# Altium schematic sheet alu_schem_2.SchDoc
size A; SheetNumber: 2; SheetTotal: 3
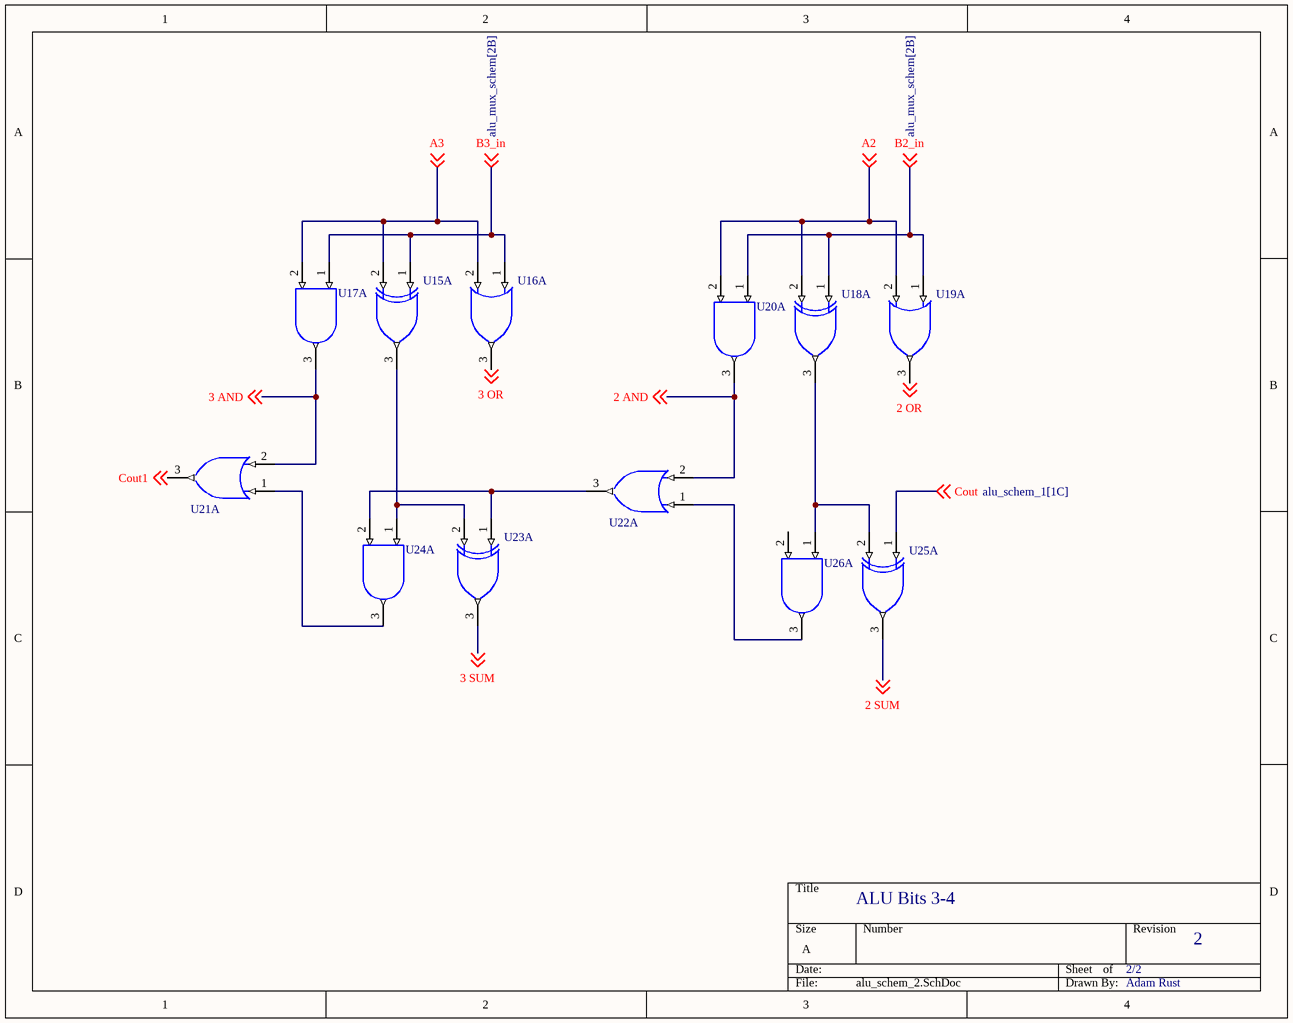
[diagram p0: alu_schem_2.SchDoc]

## Parts
U15  SN74LVC86ARGYR  [RGY0014A_V]  (value not drawn)  (part A of 5)
U16  SN74LVC32APWRG4  [PW0014A_N]  (value not drawn)  (part A of 5)
U17  SN74LVC08ADR  [D0014A_N]  (value not drawn)  (part A of 5)
U18  SN74LVC86ARGYR  [RGY0014A_V]  (value not drawn)  (part A of 5)
U19  SN74LVC32APWRG4  [PW0014A_N]  (value not drawn)  (part A of 5)
U20  SN74LVC08ADR  [D0014A_N]  (value not drawn)  (part A of 5)
U21  SN74LVC32APWRG4  [PW0014A_N]  (value not drawn)  (part A of 5)
U22  SN74LVC32APWRG4  [PW0014A_N]  (value not drawn)  (part A of 5)
U23  SN74LVC86ARGYR  [RGY0014A_V]  (value not drawn)  (part A of 5)
U24  SN74LVC08ADR  [D0014A_N]  (value not drawn)  (part A of 5)
U25  SN74LVC86ARGYR  [RGY0014A_V]  (value not drawn)  (part A of 5)
U26  SN74LVC08ADR  [D0014A_N]  (value not drawn)  (part A of 5)

## Nets
2 AND: U20.3(1Y) U22.2(1B) ; off-sheet 2 AND
2 OR: U19.3(1Y) ; off-sheet 2 OR
2 SUM: U25.3(1Y) ; off-sheet 2 SUM
3 AND: U17.3(1Y) U21.2(1B) ; off-sheet 3 AND
3 OR: U16.3(1Y) ; off-sheet 3 OR
3 SUM: U23.3(1Y) ; off-sheet 3 SUM
A2: U18.2(1B) U19.2(1B) U20.2(1B) ; off-sheet A2
A3: U15.2(1B) U16.2(1B) U17.2(1B) ; off-sheet A3
B2_in: U18.1(1A) U19.1(1A) U20.1(1A) ; off-sheet B2_in
B3_in: U15.1(1A) U16.1(1A) U17.1(1A) ; off-sheet B3_in
Cout: U25.1(1A) ; off-sheet Cout
Cout1: U21.3(1Y) ; off-sheet Cout1
NetU15_3: U15.3(1Y) U23.2(1B) U24.1(1A)
NetU18_3: U18.3(1Y) U25.2(1B) U26.1(1A)
NetU21_1: U21.1(1A) U24.3(1Y)
NetU22_1: U22.1(1A) U26.3(1Y)
NetU22_3: U22.3(1Y) U23.1(1A) U24.2(1B)

Not connected (* = marked no-connect by the designer): U26 2(1B)

## Notes on the sheet
- ALU Bits 3-4
- 2/2
- 2
- Adam Rust

## Library data of the parts
U15 U18 U23 U25 = CMP-0778-00157-4: Quadruple 2-Input Exclusive-OR Gate, RGY0014A, LARGE T&R; Manufacturer: Texas Instruments; Bits(#): 4; Output Type: TTL; Schmitt Trigger: No; VCC(Min)(V): 1.65; tpd @ Nom Voltage(Max)(ns): 9.9,7.6,5.6,4.6; Voltage(Nom)(V): 1.8,2.5,2.7,3.3; VCC(Max)(V): 3.6; Output Drive (IOL/IOH)(Max)(mA): 24/-24; Rating: Catalog; ICC @ Nom Voltage(Max)(mA): 0.01; F @ Nom Voltage(Max)(Mhz): 70; Technology Family: LVC; PackageReference: RGY0014A; DatasheetVersion: SCAS288P; Generic Part Number: SN74LVC86A; Input Type: TTL; Operating Temperature Range(C): -40 to 125
U16 U19 U21 U22 = CMP-1573-00193-3: Quadruple 2-Input Positive-OR Gate, PW0014A, LARGE T&R; Manufacturer: Texas Instruments; ICC @ Nom Voltage(Max)(mA): 0.04; VCC(Max)(V): 3.6; F @ Nom Voltage(Max)(Mhz): 70; VCC(Min)(V): 1.65; Voltage(Nom)(V): 1.8,2.5,2.7,3.3; Input Type: TTL; Bits(#): 4; Output Drive (IOL/IOH)(Max)(mA): 24/-24; tpd @ Nom Voltage(Max)(ns): 8.7,5.4,4.4,3.8; Rating: Catalog; DatasheetVersion: SCAS286Q; Operating Temperature Range(C): -40 to 105,-40 to 125; Generic Part Number: SN74LVC32A; PackageVersion: http://www.ti.com/lit/ml/mpds360/mpds360.pdf; PackageReference: PW0014A; Code_JEDEC: MO-153; Output Type: TTL
U17 U20 U24 U26 = CMP-0777-00108-3: Quadruple 2-Input Positive-AND Gate, D0014A, LARGE T&R; Manufacturer: Texas Instruments; Input Type: TTL; Output Drive (IOL/IOH)(Max)(mA): -24/24; Rating: Catalog; Technology Family: LVC; tpd @ Nom Voltage(Max)(ns): 9.8,6.9,4.8,4.1; ICC @ Nom Voltage(Max)(mA): 0.01; Voltage(Nom)(V): 1.8,2.5,2.7,3.3; F @ Nom Voltage(Max)(Mhz): 70; Schmitt Trigger: No; Bits(#): 4; VCC(Max)(V): 3.6; VCC(Min)(V): 1.65; Generic Part Number: SN74LVC08A; Output Type: TTL; DatasheetVersion: SCAS283Q; Operating Temperature Range(C): -40 to 125; PackageReference: D0014A